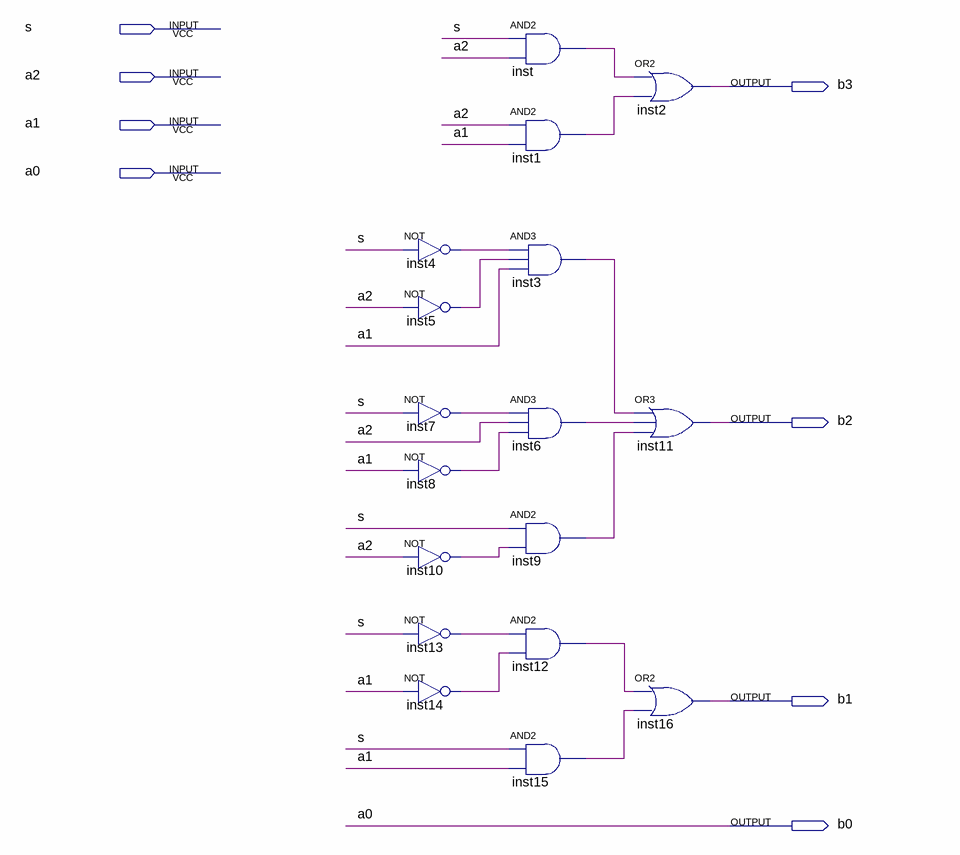
[diagram p0: schematic sheet]
// Quartus schematic hw01.bdf as structural Verilog: 17 symbols, 8 pins
module hw01 (
  input  s,
  input  a2,
  input  a1,
  input  a0,
  output b3,
  output b2,
  output b1,
  output b0
);

  wire inst1_out, inst3_out, inst4_out, inst5_out, inst6_out, inst7_out, inst8_out, inst9_out, inst10_out,
       inst12_out, inst13_out, inst14_out, inst15_out, inst_out;

  not inst4 (inst4_out, s);
  not inst5 (inst5_out, a2);
  not inst7 (inst7_out, s);
  not inst8 (inst8_out, a1);
  not inst10 (inst10_out, a2);
  not inst13 (inst13_out, s);
  not inst14 (inst14_out, a1);
  and inst (inst_out, s, a2);
  and inst1 (inst1_out, a2, a1);
  and inst3 (inst3_out, inst4_out, inst5_out, a1);
  and inst6 (inst6_out, inst7_out, a2, inst8_out);
  and inst9 (inst9_out, s, inst10_out);
  and inst12 (inst12_out, inst13_out, inst14_out);
  and inst15 (inst15_out, s, a1);
  or inst2 (b3, inst_out, inst1_out);
  or inst11 (b2, inst3_out, inst6_out, inst9_out);
  or inst16 (b1, inst12_out, inst15_out);

  assign b0 = a0;
endmodule
